# Altium schematic sheet ADF4351_10X2_v1.SchDoc
size A4; SheetNumber: 9; SheetTotal: 13
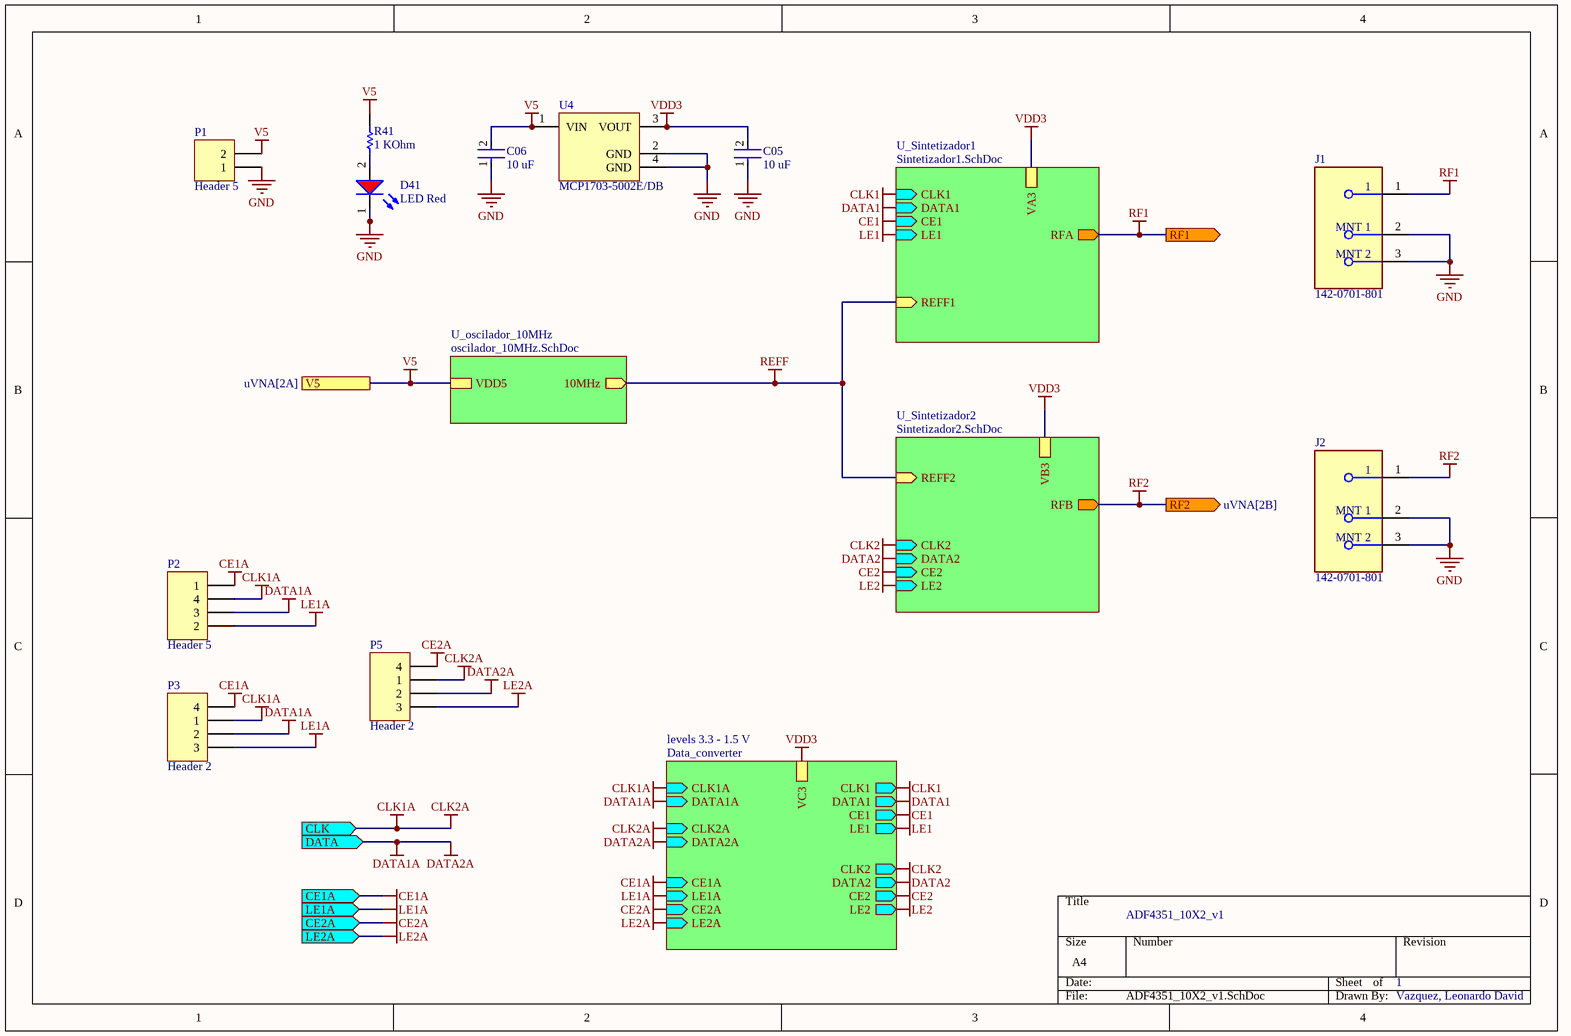
[diagram p0: ADF4351_10X2_v1.SchDoc]

## Parts
C05  10 uF  [FP-CC0805-0_85-MFG]
C06  10 uF  [FP-CC0805-0_85-MFG]
D41  LED Red  [WL-SMCW_0805_150080xx75000]
J1  142-0701-801  [FP-142-0701-801-MFG]
J2  142-0701-801  [FP-142-0701-801-MFG]
P1  Header 5  [HDR1X5]
P2  Header 5  [HDR1X5]
P3  Header 2  [HDR1X2]
P5  Header 2  [HDR1X2]
R41  1 KOhm  [RESC2013X60X40ML20T25]
U4  MCP1703-5002E/DB  [SOT-223-DB3_N]

## Sub-sheets
levels 3.3 - 1.5 V = Data_converter: CLK1 (out), DATA1 (out), CE1 (out), LE1 (out), CLK2 (out), DATA2 (out), CE2 (out), LE2 (out), CLK1A (in), DATA1A (in), CLK2A (in), DATA2A (in), CE1A (in), LE1A (in), CE2A (in), LE2A (in), VC3
U_oscilador_10MHz = oscilador_10MHz.SchDoc: VDD5, 10MHz (out)
U_Sintetizador1 = Sintetizador1.SchDoc: REFF1 (in), VA3, RFA (out), LE1 (in), CE1 (in), DATA1 (in), CLK1 (in)
U_Sintetizador2 = Sintetizador2.SchDoc: REFF2 (in), VB3, RFB (out), CLK2 (in), DATA2 (in), CE2 (in), LE2 (in)

## Ports
CE1A (in, see uVNA[2B], Data_converter[1A], PIC18F4550[2A]), CE2A (in, see uVNA[2B], Data_converter[3A], PIC18F4550[2A]), CLK (in, see uVNA[2B], PIC18F4550[2A]), DATA (in, see uVNA[2B], PIC18F4550[2A]), LE1A (in, see uVNA[2B], Data_converter[1C], PIC18F4550[2A]), LE2A (in, see uVNA[2B], Data_converter[3C], PIC18F4550[2A]), RF1 (out, see uVNA[2B]), RF2 (out, see uVNA[2B]), V5 (see uVNA[2A])

## Nets
CE1: sheet U_Sintetizador1/CE1, sheet levels 3.3 - 1.5 V/CE1
CE1A: P2.1 P3.4 ; port CE1A, sheet levels 3.3 - 1.5 V/CE1A
CE2: sheet U_Sintetizador2/CE2, sheet levels 3.3 - 1.5 V/CE2
CE2A: P5.4 ; port CE2A, sheet levels 3.3 - 1.5 V/CE2A
CLK1: sheet U_Sintetizador1/CLK1, sheet levels 3.3 - 1.5 V/CLK1
CLK1A: P2.4 P3.1 P5.1 ; port CLK, sheet levels 3.3 - 1.5 V/CLK1A, sheet levels 3.3 - 1.5 V/CLK2A  [also labelled CLK2A]
CLK2: sheet U_Sintetizador2/CLK2, sheet levels 3.3 - 1.5 V/CLK2
DATA1: sheet U_Sintetizador1/DATA1, sheet levels 3.3 - 1.5 V/DATA1
DATA1A: P2.3 P3.2 P5.2 ; port DATA, sheet levels 3.3 - 1.5 V/DATA1A, sheet levels 3.3 - 1.5 V/DATA2A  [also labelled DATA2A]
DATA2: sheet U_Sintetizador2/DATA2, sheet levels 3.3 - 1.5 V/DATA2
GND: C05.1 C06.1 D41.1(K) J1.2(MNT_1) J1.3(MNT_2) J2.2(MNT_1) J2.3(MNT_2) P1.1 U4.2(GND) U4.4(GND)
LE1: sheet U_Sintetizador1/LE1, sheet levels 3.3 - 1.5 V/LE1
LE1A: P2.2 P3.3 ; port LE1A, sheet levels 3.3 - 1.5 V/LE1A
LE2: sheet U_Sintetizador2/LE2, sheet levels 3.3 - 1.5 V/LE2
LE2A: P5.3 ; port LE2A, sheet levels 3.3 - 1.5 V/LE2A
REFF: sheet U_oscilador_10MHz/10MHz, sheet U_Sintetizador1/REFF1, sheet U_Sintetizador2/REFF2
RF1: J1.1 ; port RF1, sheet U_Sintetizador1/RFA
RF2: J2.1 ; port RF2, sheet U_Sintetizador2/RFB
V5: C06.2 P1.2 R41.2 U4.1(VIN) ; port V5, sheet U_oscilador_10MHz/VDD5
VDD3: C05.2 U4.3(VOUT) ; sheet U_Sintetizador1/VA3, sheet U_Sintetizador2/VB3, sheet levels 3.3 - 1.5 V/VC3
NetD41_2: D41.2(A) R41.1

## Notes on the sheet
- ADF4351_10X2_v1
- 1
- Vazquez, Leonardo David

## Library data of the parts
C05 C06 = CMP-2100-03606-3: CAP CER 0.1UF 50V X7R 0805; Manufacturer Part Number: CC0805KRX7R9BB104; Manufacturer: Yageo; Tolerance: 0.1; Capacitance: 100 nF; Value: 100 nF; Material: Ceramic; Device Class L1: Passive Components; ComponentLink2Description: Datasheet; Package: CC0805-0.85; Digikey Description: CAP CER 0.1UF 50V X7R 0805; Device Class L3: Ceramic Capacitors; Temperature: -30°C to +85°C; Temperature Characteristic: X7R; Voltage Rating: 50 V; Height: 0.95mm; RoHS: TRUE; Ipc Land Pattern Name: CAPC200125X85; Device Class L2: Capacitors; Category: Cap; Temperature Range Low: -30°C; Temperature Range High: +85°C; Mouser Description: Multilayer Ceramic Capacitors MLCC - SMD/SMT 100nF 50V X7R 10%; Footprint Url: http://www.yageo.com/exep/pages/download/literatures/UPY-C_GEN_24.pdf; Automotive: No; Octopart: https://octopart.com/cc0805krx7r9bb104-yageo-192993; Lead Free: Yes; ComponentLink2URL: http://www.yageo.com/documents/recent/UPY-GPHC_Y5V_6.3V-to-50V_8.pdf
D41 = CMP-1426-00011-2: NexarPartId: 29717781; Peak Wavelength: 630nm; Wavelength: 625nm; Viewing Angle: 140°; Test Current: 20mA; Forward Voltage: 2V; Forward Current: 100mA; Lens Style: Clear, Rectangular; Luminous Intensity: 150mcd; Max Reverse Voltage (DC): 5V; Length: 2mm; Case Code (Imperial): 0805; RoHS: Compliant; Max Operating Temperature: 85°C; Height: 700µm; Packaging: Tape and Reel; Color: Red; Case/Package: 0805; REACH SVHC: Unknown; Dominant Wavelength: 625nm; Min Operating Temperature: -40°C; Case Code (Metric): 2012; Mount: Surface Mount; Width: 1.25mm
J1 J2 = CMP-09588-000002-1: CONN SMA JACK STR 50OHM EDGE MNT; Frequency: 18GHz; Operating Frequency: 0 to 18 GHz; Body Material: Brass; Impedance: 50R; Voltage Rating: 335V; Gender: Female; Body Plating: Gold; Orientation: Straight; Length: 0.44inch; Max Operating Temperature: 165°C; Package Quantity: 5; Packaging: Bulk; Series: SMA; Contact Material: Copper; Min Operating Temperature: -65°C; Depth: 25.58mm; RoHS Compliant: Yes; Case/Package: SMA; Max Frequency: 18GHz; Radiation Hardening: No; Contact Plating: Gold; Mount: Edge; Connector Type: SMA; Fastening Type: Threaded; Termination: Solder
P1 = Header 2: Header, 2-Pin; LatestRevisionDate: 17-Jul-2002; LatestRevisionNote: Re-released for DXP Platform.; Publisher: Altium Limited
P2 P3 P5 = Header 4: Header, 4-Pin; LatestRevisionDate: 17-Jul-2002; LatestRevisionNote: Re-released for DXP Platform.; Publisher: Altium Limited
R41 = CMP-2001-00580-1: Manufacturer: Panasonic; Part Number: ERA6AEB101V
U4 = MCP1703-5002E/DB: 250 mA, 16V, Low Quiescent Current LDO Regulator, 3-Pin SOT-223, Extended Temperature; Published: 29-Jan-2009; DatasheetVersion: revD, Sep-2009; PackageVersion: revBB, Aug-2009; PackageReference: SOT-223-DB3; Publisher: Altium Limited; PackageDescription: 3-Lead Plastic Small Outline Transistor (DB) [SOT-223]; Supplier 1: Digi-Key; Supplier Part Number 1: MCP1703-5002E/DB-ND; Supplier 2: Farnell; Supplier Part Number 2: 1627178; ComponentLink1Description: Datasheet; ComponentLink1URL: http://ww1.microchip.com/downloads/en/DeviceDoc/22049d.pdf; ComponentLink2Description: Packaging Specification; ComponentLink2URL: http://www.microchip.com/stellent/groups/techpub_sg/documents/packagingspec/en012702.pdf; ComponentLink3Description: Microchip.com Home; ComponentLink3URL: http://www.microchip.com/